# Altium schematic sheet MC21R01_Inverter_1.SchDoc: MC21R01 Top Level
size A3; Author: AMP; DrawnBy: AMP; Organization: Altium Limited; Address1: 3 Minna Close; Address2: Belrose; Address3: NSW 2085; Address4: Australia; DocumentNumber: 0; Revision: 1.0; SheetNumber: 0; SheetTotal: 0
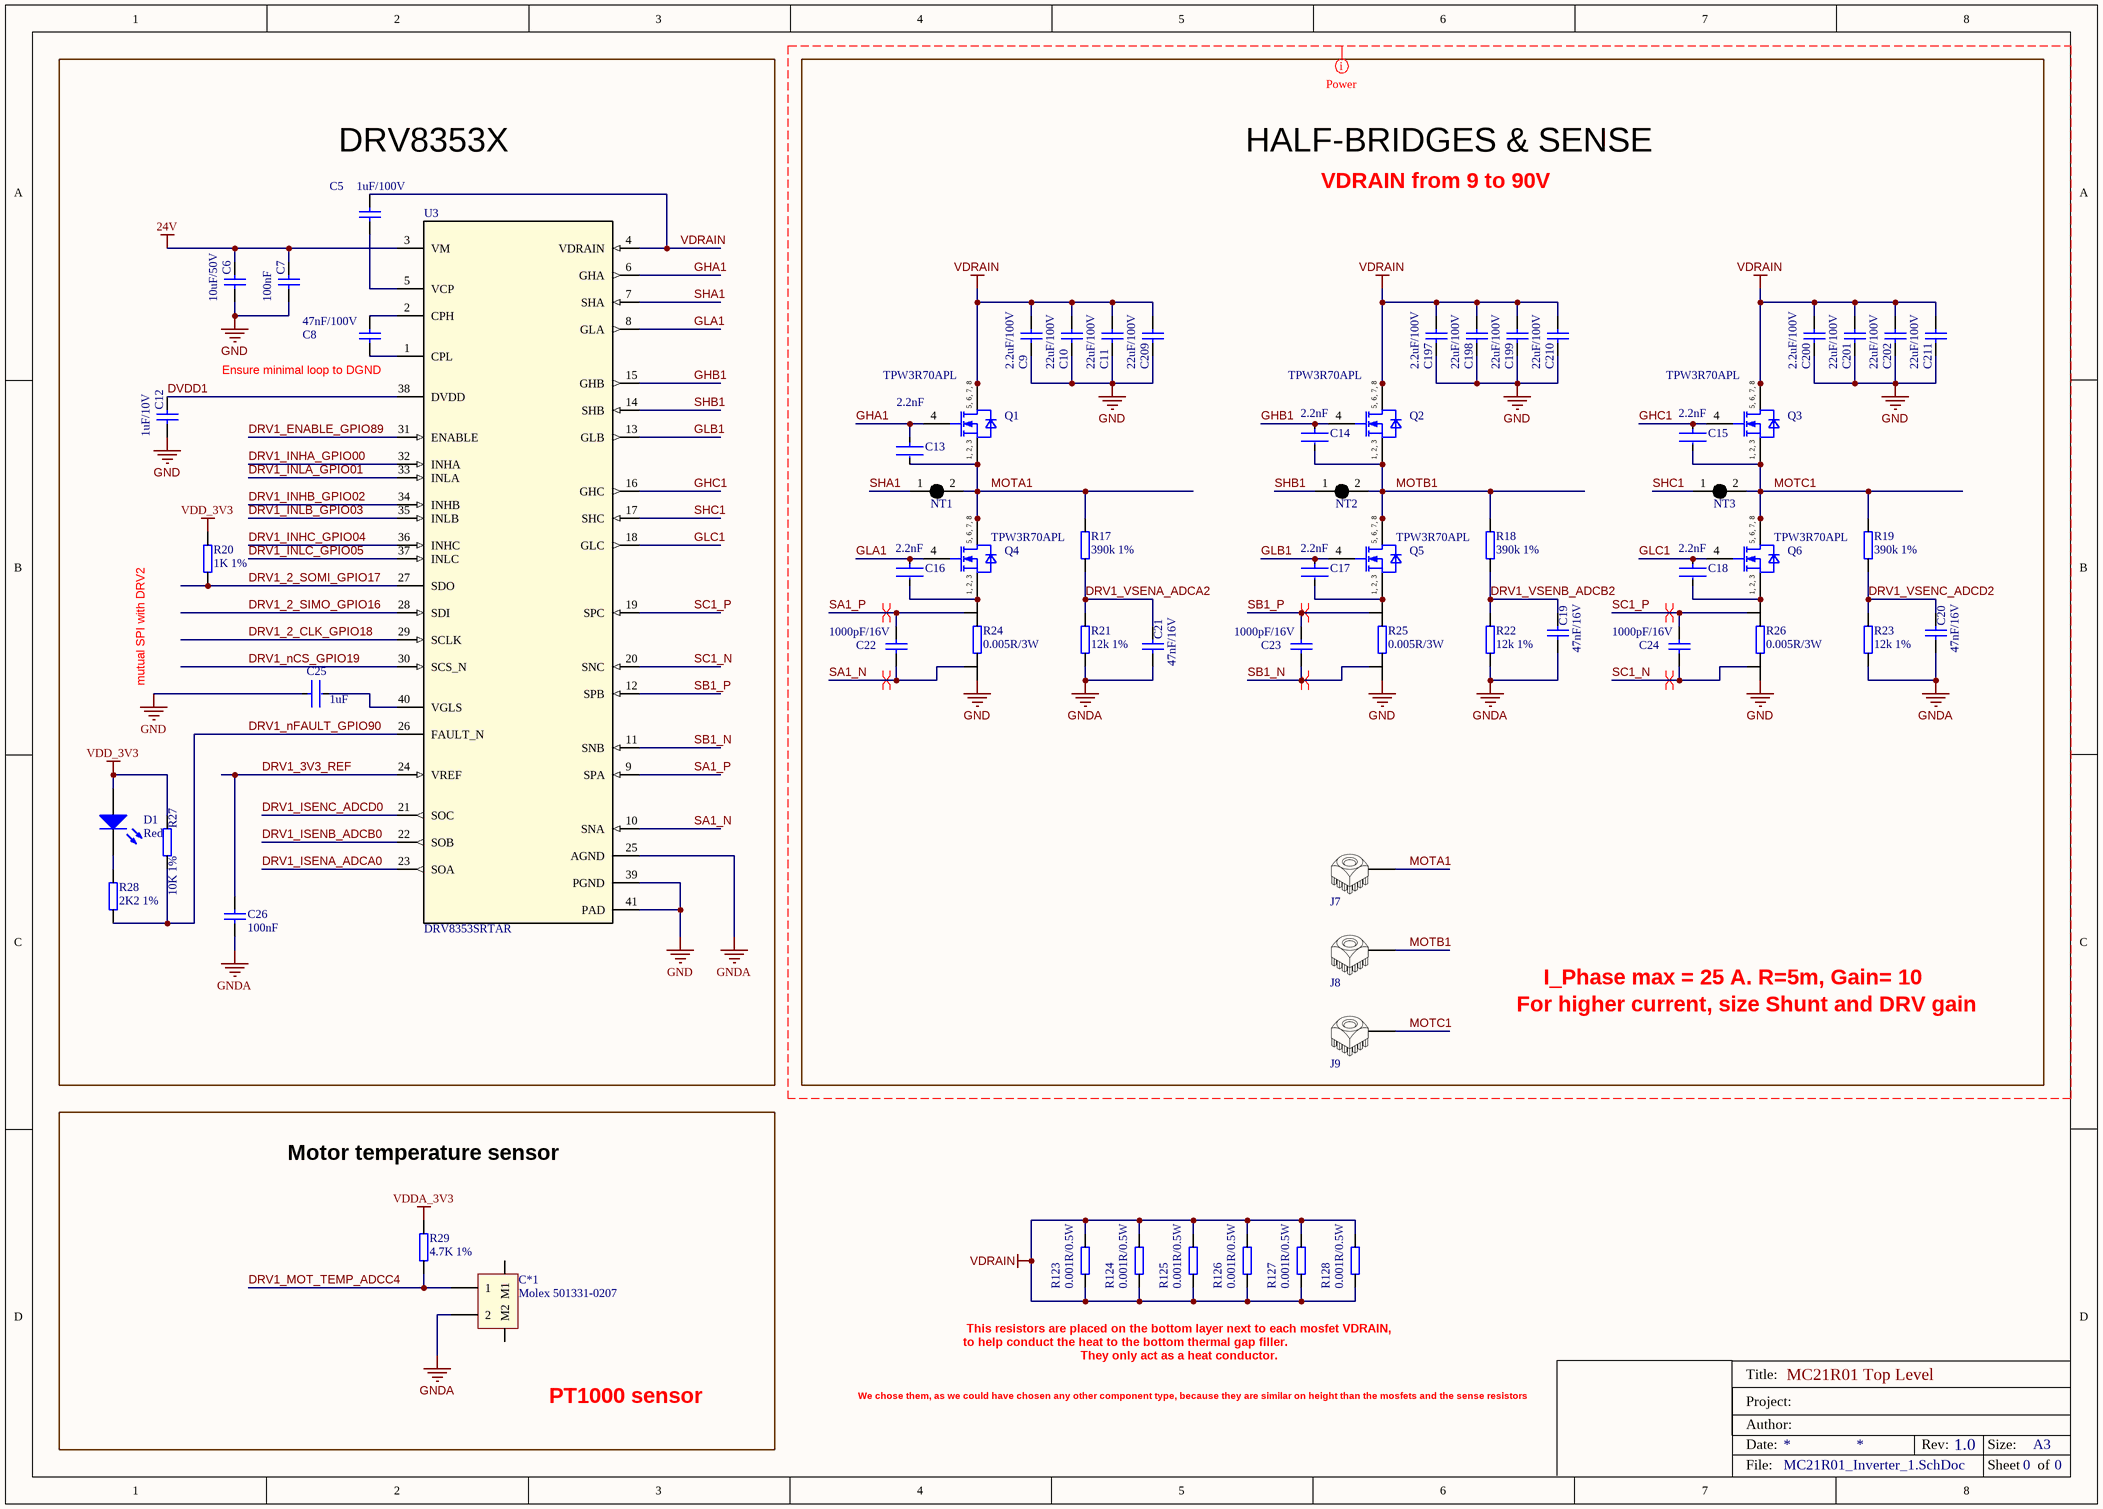
[diagram p0: MC21R01_Inverter_1.SchDoc]

## Parts
C5  value 1uF/100V  [0805 SMD capacitor]  (hidden comment: 1uF/100V 0805 10% X7R)
C6  value 10uF/50V  [1206 SMD Capacitor]  (hidden comment: 10uf/50V 1206 20% X5R)
C7  value 100nF  [CAPC0603X03N]  (hidden comment: 100nF/25V 0201 10% X6S)
C8  value 47nF/100V  [0603 SMD capacitor]  (hidden comment: 47nF/100V 0603 10% X7R)
C9  value 2.2uF/100V  [1210 SMD capacitor h=2mm]  (hidden comment: 2.2uF/100V 1210 10% X7R)
C10  value 22uF/100V  [2220 SMD Capacitor H=5MM]  (hidden comment: 22uF/100V 2220 20% X7S)
C11  value 22uF/100V  [2220 SMD Capacitor H=5MM]  (hidden comment: 22uF/100V 2220 20% X7S)
C12  value 1uF/10V  [0603 SMD capacitor]  (hidden comment: 1uF/10V 0603 10% X7R)
C13  Capacitance: 2.2nF  [FP-GRM033-0_03-IPC_A]  (hidden comment: 2200pF/50V 0201 10% X7R)
C14  Capacitance: 2.2nF  [FP-GRM033-0_03-IPC_A]  (hidden comment: 2200pF/50V 0201 10% X7R)
C15  Capacitance: 2.2nF  [FP-GRM033-0_03-IPC_A]  (hidden comment: 2200pF/50V 0201 10% X7R)
C16  Capacitance: 2.2nF  [FP-GRM033-0_03-IPC_A]  (hidden comment: 2200pF/50V 0201 10% X7R)
C17  Capacitance: 2.2nF  [FP-GRM033-0_03-IPC_A]  (hidden comment: 2200pF/50V 0201 10% X7R)
C18  Capacitance: 2.2nF  [FP-GRM033-0_03-IPC_A]  (hidden comment: 2200pF/50V 0201 10% X7R)
C19  value 47nF/16V  [0402 SMD Capacitor]  (hidden comment: 47nF/16V 0402 10% X7R)
C20  value 47nF/16V  [0402 SMD Capacitor]  (hidden comment: 47nF/16V 0402 10% X7R)
C21  value 47nF/16V  [0402 SMD Capacitor]  (hidden comment: 47nF/16V 0402 10% X7R)
C22  value 1000pF/16V  [0402 SMD Capacitor]  (hidden comment: 1000pF/16V 0402 10% X7R)
C23  value 1000pF/16V  [0402 SMD Capacitor]  (hidden comment: 1000pF/16V 0402 10% X7R)
C24  value 1000pF/16V  [0402 SMD Capacitor]  (hidden comment: 1000pF/16V 0402 10% X7R)
C25  Capacitance: 1uF  [FP-CL03-IPC_A]  (hidden comment: 1uF/6.3V 0201 10% X5R)
C26  value 100nF  [CAPC0603X03N]  (hidden comment: 100nF/25V 0201 10% X6S)
C197  value 2.2uF/100V  [1210 SMD capacitor h=2mm]  (hidden comment: 2.2uF/100V 1210 10% X7R)
C198  value 22uF/100V  [2220 SMD Capacitor H=5MM]  (hidden comment: 22uF/100V 2220 20% X7S)
C199  value 22uF/100V  [2220 SMD Capacitor H=5MM]  (hidden comment: 22uF/100V 2220 20% X7S)
C200  value 2.2uF/100V  [1210 SMD capacitor h=2mm]  (hidden comment: 2.2uF/100V 1210 10% X7R)
C201  value 22uF/100V  [2220 SMD Capacitor H=5MM]  (hidden comment: 22uF/100V 2220 20% X7S)
C202  value 22uF/100V  [2220 SMD Capacitor H=5MM]  (hidden comment: 22uF/100V 2220 20% X7S)
C209  value 22uF/100V  [2220 SMD Capacitor H=5MM]  (hidden comment: 22uF/100V 2220 20% X7S)
C210  value 22uF/100V  [2220 SMD Capacitor H=5MM]  (hidden comment: 22uF/100V 2220 20% X7S)
C211  value 22uF/100V  [2220 SMD Capacitor H=5MM]  (hidden comment: 22uF/100V 2220 20% X7S)
C*1  Molex 501331-0207  [Molex 501331-0207]
D1  Red  [0402 SMD LED Red]
J7  WE_7461094  [WE_7461094]  (value not drawn)
J8  WE_7461094  [WE_7461094]  (value not drawn)
J9  WE_7461094  [WE_7461094]  (value not drawn)
NT1  Net Tie SMD  [Net Tie SMD 0.4x0.8mm]  (value not drawn)  (net tie, no BOM)
NT2  Net Tie SMD  [Net Tie SMD 0.4x0.8mm]  (value not drawn)  (net tie, no BOM)
NT3  Net Tie SMD  [Net Tie SMD 0.4x0.8mm]  (value not drawn)  (net tie, no BOM)
Q1  TPW3R70APL  [DSOP Advance Toshiba]
Q2  TPW3R70APL  [DSOP Advance Toshiba]
Q3  TPW3R70APL  [DSOP Advance Toshiba]
Q4  TPW3R70APL  [DSOP Advance Toshiba]
Q5  TPW3R70APL  [DSOP Advance Toshiba]
Q6  TPW3R70APL  [DSOP Advance Toshiba]
R17  390k 1%  [0603 SMD resistor]
R18  390k 1%  [0603 SMD resistor]
R19  390k 1%  [0603 SMD resistor]
R20  1K 1%  [0402 SMD rESISTOR]
R21  12k 1%  [0603 SMD resistor]
R22  12k 1%  [0603 SMD resistor]
R23  12k 1%  [0603 SMD resistor]
R24  0.005R/3W  [2512 SMD Resistor V2 NETTIE]
R25  0.005R/3W  [2512 SMD Resistor V2 NETTIE]
R26  0.005R/3W  [2512 SMD Resistor V2 NETTIE]
R27  10K 1%  [0402 SMD rESISTOR]
R28  2K2 1%  [0402 SMD rESISTOR]
R29  4.7K 1%  [0402 SMD rESISTOR]
R123  0.001R/0.5W  [2010 SMD Resistor VERTICAL]
R124  0.001R/0.5W  [2010 SMD Resistor VERTICAL]
R125  0.001R/0.5W  [2010 SMD Resistor VERTICAL]
R126  0.001R/0.5W  [2010 SMD Resistor VERTICAL]
R127  0.001R/0.5W  [2010 SMD Resistor VERTICAL]
R128  0.001R/0.5W  [2010 SMD Resistor VERTICAL]
U3  DRV8353SRTAR  [QFN50P600X600X80_HS-41N]

## Blocks framed on the sheet
DRV8353X: C5-C8 C12 C25 C26 D1 R20 R27 R28 U3
HALF-BRIDGES & SENSE: C9-C11 C13-C24 C197-C202 C209-C211 J7-J9 NT1-NT3 Q1-Q6 R17-R19 R21-R26

## Nets
24V: C6.1 C7.2 U3.3(VM)
GND: C6.2 C7.1 C9.2 C10.2 C11.2 C12.2 C25.1 C197.2 C198.2 C199.2 C200.2 C201.2 C202.2 C209.2 C210.2 C211.2 R24.1 R25.1 R26.1 U3.39(PGND) U3.41(PAD)
GNDA: C19.2 C20.2 C21.2 C26.1 C*1.2 R21.1 R22.1 R23.1 U3.25(AGND)
VDD_3V3: D1.A R20.2 R27.2
VDDA_3V3: R29.2
VDRAIN: C5.1 C9.1 C10.1 C11.1 C197.1 C198.1 C199.1 C200.1 C201.1 C202.1 C209.1 C210.1 C211.1 Q1.5(DRAIN) Q1.6(DRAIN) Q1.7(DRAIN) Q1.8(DRAIN) Q2.5(DRAIN) Q2.6(DRAIN) Q2.7(DRAIN) Q2.8(DRAIN) Q3.5(DRAIN) Q3.6(DRAIN) Q3.7(DRAIN) Q3.8(DRAIN) R123.1 R123.2 R124.1 R124.2 R125.1 R125.2 R126.1 R126.2 R127.1 R127.2 R128.1 R128.2 U3.4(VDRAIN)
DRV1_2_CLK_GPIO18: U3.29(SCLK)
DRV1_2_SIMO_GPIO16: U3.28(SDI)
DRV1_2_SOMI_GPIO17: R20.1 U3.27(SDO)
DRV1_3V3_REF: C26.2 U3.24(VREF)
DRV1_ENABLE_GPIO89: U3.31(ENABLE)
DRV1_INHA_GPIO00: U3.32(INHA)
DRV1_INHB_GPIO02: U3.34(INHB)
DRV1_INHC_GPIO04: U3.36(INHC)
DRV1_INLA_GPIO01: U3.33(INLA)
DRV1_INLB_GPIO03: U3.35(INLB)
DRV1_INLC_GPIO05: U3.37(INLC)
DRV1_ISENA_ADCA0: U3.23(SOA)
DRV1_ISENB_ADCB0: U3.22(SOB)
DRV1_ISENC_ADCD0: U3.21(SOC)
DRV1_MOT_TEMP_ADCC4: C*1.1 R29.1
DRV1_nCS_GPIO19: U3.30(SCS_N)
DRV1_nFAULT_GPIO90: R27.1 R28.1 U3.26(FAULT_N)
DRV1_VSENA_ADCA2: C21.1 R17.1 R21.2
DRV1_VSENB_ADCB2: C19.1 R18.1 R22.2
DRV1_VSENC_ADCD2: C20.1 R19.1 R23.2
DVDD1: C12.1 U3.38(DVDD)
GHA1: C13.1 Q1.4(GATE) U3.6(GHA)
GHB1: C14.1 Q2.4(GATE) U3.15(GHB)
GHC1: C15.1 Q3.4(GATE) U3.16(GHC)
GLA1: C16.1 Q4.4(GATE) U3.8(GLA)
GLB1: C17.1 Q5.4(GATE) U3.13(GLB)
GLC1: C18.1 Q6.4(GATE) U3.18(GLC)
MOTA1: C13.2 J7.1 NT1.2 Q1.1(SOURCE) Q1.2(SOURCE) Q1.3(SOURCE) Q4.5(DRAIN) Q4.6(DRAIN) Q4.7(DRAIN) Q4.8(DRAIN) R17.2
MOTB1: C14.2 J8.1 NT2.2 Q2.1(SOURCE) Q2.2(SOURCE) Q2.3(SOURCE) Q5.5(DRAIN) Q5.6(DRAIN) Q5.7(DRAIN) Q5.8(DRAIN) R18.2
MOTC1: C15.2 J9.1 NT3.2 Q3.1(SOURCE) Q3.2(SOURCE) Q3.3(SOURCE) Q6.5(DRAIN) Q6.6(DRAIN) Q6.7(DRAIN) Q6.8(DRAIN) R19.2
SA1_N: C22.2 R24.3 U3.10(SNA)
SA1_P: C22.1 R24.4 U3.9(SPA)
SB1_N: C23.2 R25.3 U3.11(SNB)
SB1_P: C23.1 R25.4 U3.12(SPB)
SC1_N: C24.2 R26.3 U3.20(SNC)
SC1_P: C24.1 R26.4 U3.19(SPC)
SHA1: NT1.1 U3.7(SHA)
SHB1: NT2.1 U3.14(SHB)
SHC1: NT3.1 U3.17(SHC)
NetC5_2: C5.2 U3.5(VCP)
NetC8_1: C8.1 U3.2(CPH)
NetC8_2: C8.2 U3.1(CPL)
NetC16_2: C16.2 Q4.1(SOURCE) Q4.2(SOURCE) Q4.3(SOURCE) R24.2
NetC17_2: C17.2 Q5.1(SOURCE) Q5.2(SOURCE) Q5.3(SOURCE) R25.2
NetC18_2: C18.2 Q6.1(SOURCE) Q6.2(SOURCE) Q6.3(SOURCE) R26.2
NetC25_2: C25.2 U3.40(VGLS)
NetD1_K: D1.K R28.2

Not connected (* = marked no-connect by the designer): C*1 M1 M2

## Layout directives
net class Power: DRV1_VSENA_ADCA2, DRV1_VSENB_ADCB2, DRV1_VSENC_ADCD2, GHA1, GHB1, GHC1, GLA1, GLB1, GLC1, GND, GNDA, MOTA1, MOTB1, MOTC1, SA1_N, SA1_P, SB1_N, SB1_P, SC1_N, SC1_P, SHA1, SHB1, SHC1, VDRAIN
differential pair; differential pair class ADC; differential pair class ADC: SA1_P
differential pair; differential pair class ADC: SA1_N, SB1_N, SB1_P, SC1_N, SC1_P

## Notes on the sheet
- VDRAIN from 9 to 90V
- (near C8) Ensure minimal loop to DGND
- mutual SPI with DRV2
- I_Phase max = 25 A. R=5m, Gain= 10
- For higher current, size Shunt and DRV gain
- Motor temperature sensor
- This resistors are placed on the bottom layer next to each mosfet VDRAIN,
- PT1000 sensor
- to help conduct the heat to the bottom thermal gap filler.
- They only act as a heat conductor.
- We chose them, as we could have chosen any other component type, because they are similar on height than the mosfets and the sense resistors
- Title:
- Date:
- Project:
- Author:
- Rev:
- Size:
- A3
- File:
- Sheet
- of
- (in symbol TPW3R70APL) 5, 6, 7, 8; 1, 2, 3

## Library data of the parts
C5 = 1uF/100V 0805 10% X7R: 1 uF 100 V 0805  ±10% Tolerance X7R Multilayer Ceramic Chip Capacitor; Manufacturer 1: AVX; Manufacturer Part Number 1: 08051C105K4T2A; Supplier 1: Farnell; Supplier 2: Mouser; Supplier Part Number 1: 2834935; Supplier Part Number 2: 581-08051C105K4T2A
C6 = 10uF/50V 1206 20% X5R: 10 uF 50 V 1206 ±20% Tolerance X5R Multilayer Ceramic Chip Capacitor; Manufacturer 1: Samsung; Manufacturer Part Number 1: CL31A106MBHNNNE; Supplier 1: Digi-key; Supplier Part Number 1: 1276-6736-1-ND
C7 C26 = CMP-001-00061-1: 100nF/25V 0201 10% Tolerance X6S Multilayer Ceramic Chip Capacitor; Populated: Yes; Provided by customer: No; Voltage Rating (DC): 25V; Capacitance: 100nF; Case/Package: 0201; Case Code (Imperial): 0201; Case Code (Metric): 0603; Dielectric: X6S; Height: 0.3mm; Length: 0.024inch; Max Operating Temperature: 105°C; Min Operating Temperature: -55°C; Mount: Surface Mount; Package Quantity: 15000; Packaging: Tape and Reel; Termination: SMD/SMT; Thickness: 0.013inch; Tolerance: 10%; Voltage Rating: 25V; Weight: 1.2E-05oz; Width: 0.3mm
C8 = 47nF/100V 0603 10% X7R_1: 47 nF 100 V 0603 ±10% Tolerance X7R Multilayer Ceramic Chip Capacitor; Manufacturer 1: KEMET; Manufacturer Part Number 1: C0603C473K1RACTU; Supplier 1: Farnell; Supplier Part Number 1: 1865550
C9 C197 C200 = 2.2uF/100V 1210 10% X7R: 2.2 uF 100 V 1210  ±10% Tolerance X7R Multilayer Ceramic Chip Capacitor; Manufacturer 1: KEMET; Manufacturer Part Number 1: C1210C225K1RACTU; Supplier 1: Farnell; Supplier Part Number 1: 1793832
C10 C11 C198 C199 C201 C202 C209-C211 = 22uF/100V 2220 20% X7S: 22 uF 100 V 2220 ±20% Tolerance X7S Multilayer Ceramic Chip Capacitor; Manufacturer 1: TDK; Manufacturer Part Number 1: CKG57NX7S2A226M500JH; Supplier 1: Farnell; Supplier Part Number 1: 2210742
C12 = 1uF/10V 0603 10% X7R: 1uF/10V 0603 10% Tolerance X7R Multilayer Ceramic Chip Capacitor; Manufacturer 1: TAIYO YUDEN; Manufacturer Part Number 1: LMK107B7105KA-T; Supplier Part Number 1: 2112849; Supplier 1: Farnell
C13-C18 = CMP-06035-000256-1: 2200pF/50V 0201 10% Tolerance X7R Multilayer Ceramic Chip Capacitor; Voltage Rating (DC): 25V; Depth: 0.3mm; Tolerance: 10%; Min Operating Temperature: -55°C; Max Operating Temperature: 125°C; Length: 0.6mm; Case Code (Metric): 0603; Width: 0.012inch; Height: 0.3mm; Case/Package: 0201; Mount: Surface Mount; Thickness: 0.013inch; Voltage Rating: 25V; Termination: SMD/SMT; Packaging: Tape and Reel; Package Quantity: 15000; Dielectric: X7R; Weight: 1.2E-05oz; Case Code (Imperial): 0201; Resistor Type: Ceramic
C19-C21 = 47nF/16V 0402 10% X7R: 47nF/16V 0402 10% Tolerance X7R Multilayer Ceramic Chip Capacitor; Manufacturer 1: Walsin; Manufacturer Part Number 1: 0402B473J160CT; Supplier 1: Farnell; Supplier Part Number 1: 2524710
C22-C24 = 1000pF/16V 0402 10% X7R_1: 1000pF/16V 0402 10% Tolerance X7R Multilayer Ceramic Chip Capacitor; Manufacturer 1: KEMET; Manufacturer Part Number 1: C0402C102K4RACTU; Supplier 1: Farnell; Supplier Part Number 1: 2522378
C25 = CMP-13271-003873-1: 1uF/6.3V 0201 10% Tolerance X5R Multilayer Ceramic Chip Capacitor; Voltage Rating: 6.3V; Tolerance: 20%; Lead Free: Lead Free; Packaging: Tape and Reel; Dielectric: X5R; Case Code (Imperial): 0201; Max Operating Temperature: 85°C; Case/Package: 0201; Depth: 0.3mm; Width: 0.012inch; Thickness: 0.013inch; Length: 0.024inch; Case Code (Metric): 0603; Package Quantity: 1; Min Operating Temperature: -55°C; Mount: Surface Mount
C*1 = Molex 501331-0207: PicoClasp 02 pin vertical; Supplier 1: Farnell; Supplier Part Number 1: 1835976
D1 = LED_0402_Red: Low Profile Chip LED, Red; Manufacturer: ROHM; Manufacturer Part Number: SML-P11UTT86R; Supplier 1: Farnell; Supplier Part Number 1: 2507545
J7-J9 = WE_7461094: REDCUBE PRESS-FIT with external thread and full plain pin-plate WPSHFU, 130A, M3 screw, 9pins; Manufacturer: WURTH ELEKTRONIK; Manufacturer Part Number: 7461094; Created by: Yaiza Montes; Published: 29/05/20; Value: WE_7461094; Supplier 1: Farnell; Supplier 2: Mouser; Supplier 3: Digi-Key; Supplier Part Number 1: 1821284; Supplier Part Number 2: 710-7461094; Supplier Part Number 3: 732-3212-ND
NT1-NT3 = Net Tie SMD: Net Tie starpoint
Q1-Q6 = TPW3R70APL: Silicon N-channel MOS (U-MOS-H); Manufacturer: Toshiba Semicon; Manufacturer Order Number: TPW3R70APL; PackageReference: DSOP Advance; Supplier 1: Mouser; Supplier 2: Mouser; Supplier Part Number 1: 757-TPW3R70APLL1Q; Supplier Part Number 2: 757-TPW3R70APLL1Q
R17-R19 = 390k/150V 1% 0603 250mW: 390k/150V 1% 0603 250mW SMD Resistor; Manufacturer 1: Panasonic; Manufacturer Part Number 1: ERJPA3F3903V; Supplier 1: Farnell; Supplier Part Number 1: 2335911
R20 = 1K/50V 1% 0402 100mW: 1K/50V 1% 0402 100mW SMD Resistor; Manufacturer 1: Yageo; Manufacturer Part Number 1: RC0402FR-071KL; Supplier 1: Mouser; Supplier 2: Farnell; Supplier Part Number 2: 9239235; Supplier Part Number 1: 603-RC0402FR-071KL; Value: 1K
R21-R23 = 12k/150V 1% 0603 250mW: 12k/150V 1% 0603 250mW SMD Resistor; Manufacturer 1: Panasonic; Manufacturer Part Number 1: ERJPA3F1202V; Supplier 1: Farnell; Supplier Part Number 1: 2335844
R24-R26 = 0.005R/3W 1% 2512 Shunt: 0.005R/3W 1% 2512 shunt SMD Resistor; Manufacturer 1: Bourns; Manufacturer Part Number 1: CRE2512-FZ-R005E-3; Supplier 1: Farnell; Supplier Part Number 1: 2434014
R27 = 10K/50V 1% 0402 100mW: 10K/50V 1% 0402 100mW SMD Resistor; Manufacturer 1: Yageo; Manufacturer Part Number 1: RC0402FR-0710KL; Supplier 1: Farnell; Supplier Part Number 1: 9239359; Value: 10K
R28 = 2K2/50V 1% 0402 100mW: 2K2/50V 1% 0402 100mW SMD Resistor; Manufacturer 1: Yageo; Manufacturer Part Number 1: RC0402FR-072K2L; Value: 2.2k; Supplier 1: Farnell; Supplier Part Number 1: 9239278
R29 = 4.7K/50V 1% 0402 100mW: 4.7K/50V 1% 0402 100mW SMD Resistor; Manufacturer 1: Vishay; Manufacturer Part Number 1: CRCW04024K70FKED; Supplier 1: Farnell; Supplier Part Number 1: 1469712; Value: 4.7K
R123-R128 = 0.001R/0.5W 1% 2010 Shunt: 0.001R/0.5W 1% 2010 shunt SMD Resistor; Manufacturer 1: Vishay; Manufacturer Part Number 1: WSL20101L000FEA; Supplier 1: Farnell; Supplier Part Number 1: 2678801RL
U3 = DRV8353SRTAR: 102-V max 3-phase smart gate driver with current shunt amplifiers; Manufacturer: Texas Instruments; PartNumber: DRV8353SRTAR; RefDes: RefDes; TYPE: TYPE; Value: Value; Supplier 1: Arrow; Manufacturer Part Number: DRV8353SRTAR; RoHS: No; Stock 1: 2000; Pricing 1: 2000=3,20540, 4000=3,09430, 10000=3,08440, 50000=3,06460 (USD); Supplier Part Number 1: DRV8353SRTAR